# Altium schematic sheet [1]isoSPI.SchDoc
size A4; SheetNumber: 1; SheetTotal: 2
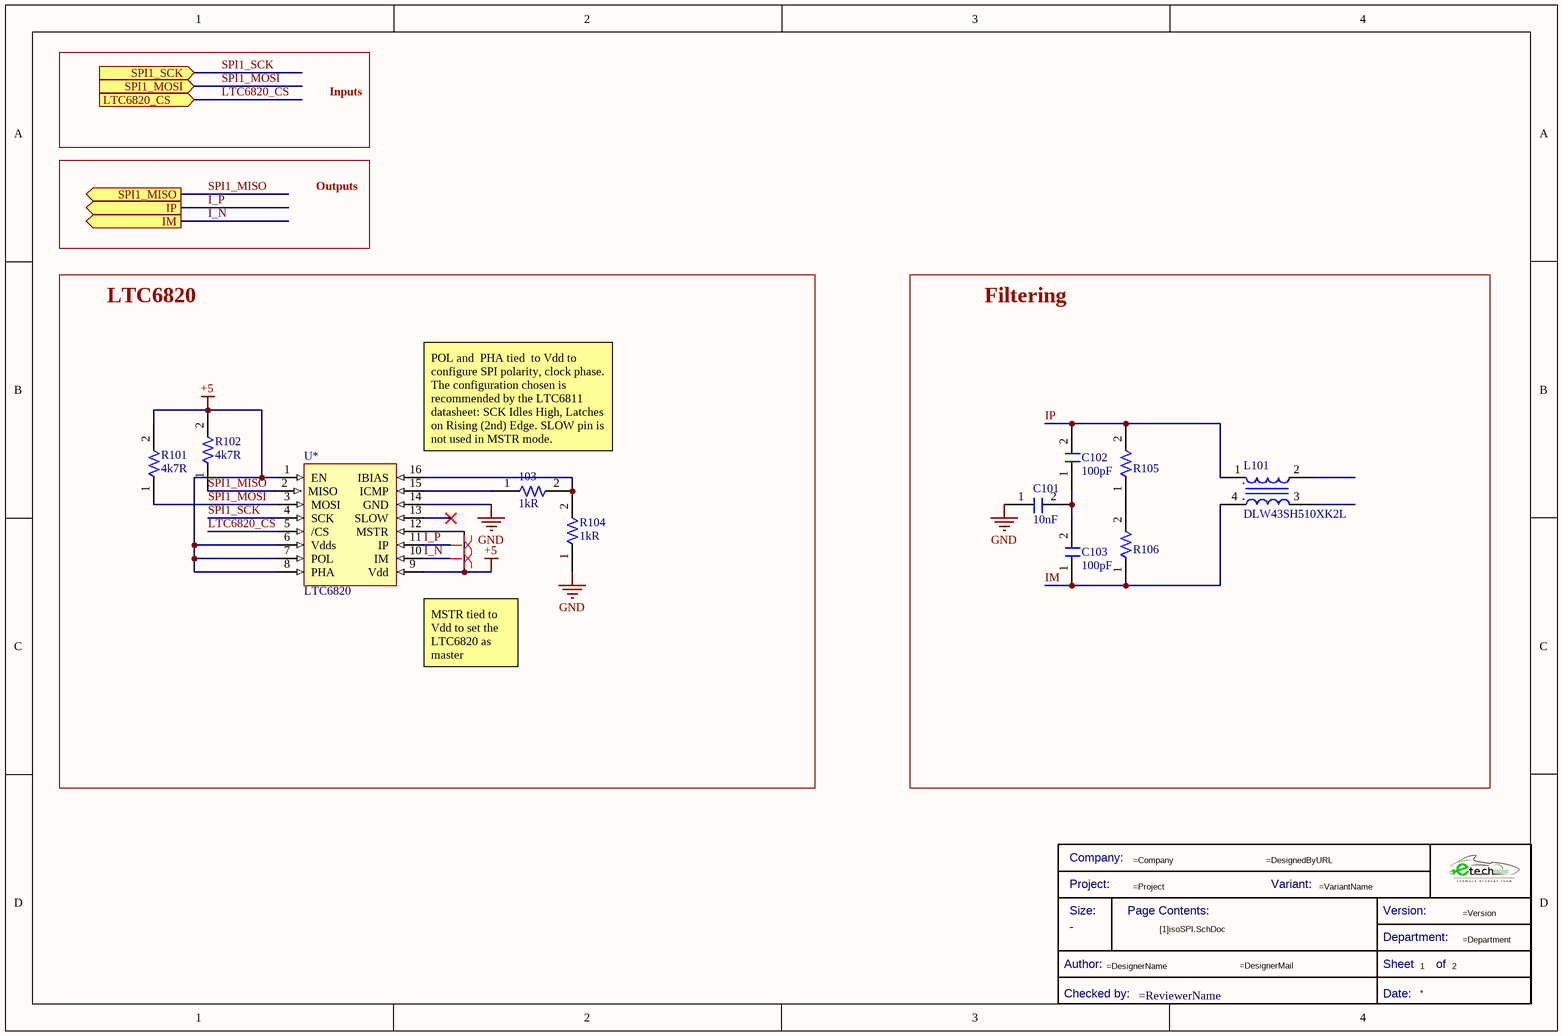
[diagram p0: [1]isoSPI.SchDoc]

## Parts
103  Resistance: 1kR  [R0805FTK]  (hidden comment: CR0805-JW-102ELF)
*  Title Block_template  (value not drawn)  (graphical)
C101  Capacitance: 10nF  [C1206FNPC-RW]  (hidden comment: 885012008055)
C102  Capacitance: 100pF  [C0805FNPC-W]  (hidden comment: 885012007057)
C103  Capacitance: 100pF  [C0805FNPC-W]  (hidden comment: 885012007057)
L101  Supplier Part Number 1: DLW43SH510XK2L  [CMC-51uH-230mA]  (hidden comment: CMC-51uH-DLW43SH510XK2L)
R101  Resistance: 4k7R  [R0805FTK]  (hidden comment: CR0805-JW-472ELF)
R102  Resistance: 4k7R  [R0805FTK]  (hidden comment: CR0805-JW-472ELF)
R104  Resistance: 1kR  [R0805FTK]  (hidden comment: CR0805-JW-102ELF)
R105  CRCW080550R0FKTA  [R0805FTK]  (value not drawn)
R106  CRCW080550R0FKTA  [R0805FTK]  (value not drawn)
U*  LTC6820  [LTC6820]

## Blocks framed on the sheet
LTC6820: 103 R101 R102 R104 U*
Filtering: C101-C103 L101 R105 R106

## Ports
IM (out), IP (out), LTC6820_CS (in), SPI1_MISO (out), SPI1_MOSI (in), SPI1_SCK (in)

## Nets
+5: R101.2 R102.2 U*.1(EN) U*.6(Vdds) U*.7(POL) U*.8(PHA) U*.9(Vdd) U*.12(MSTR)
GND: C101.1 R104.1 U*.14(GND)
I_N: U*.10(IM) ; port IM
I_P: U*.11(IP) ; port IP
IM: C103.1 L101.4(4_IN) R106.1
IP: C102.2 L101.1(1_IN) R105.2
LTC6820_CS: U*.5(/CS) ; port LTC6820_CS
SPI1_MISO: R102.1 U*.2(MISO) ; port SPI1_MISO
SPI1_MOSI: R101.1 U*.3(MOSI) ; port SPI1_MOSI
SPI1_SCK: U*.4(SCK) ; port SPI1_SCK
Net103_1: 103.1 U*.15(ICMP)
Net103_2: 103.2 R104.2 U*.16(IBIAS)
NetC101_2: C101.2 C102.1 C103.2
NetR105_1: R105.1 R106.2

Not connected (* = marked no-connect by the designer): L101 2(2_OUT) 3(3_OUT); U* 13(SLOW)*

## Layout directives
differential pair: I_N, I_P

## Notes on the sheet
- Inputs
- Outputs
- POL and  PHA tied  to Vdd to configure SPI polarity, clock phase.
  The configuration chosen is recommended by the LTC6811 datasheet: SCK Idles High, Latches on Rising (2nd) Edge. SLOW pin is not used in MSTR mode.
- (near U*) MSTR tied to Vdd to set the LTC6820 as master
- (in symbol Title Block_template) Company:; Project:; Variant:; Size:; Page Contents:; Version:; Department:; Author:; Sheet; of; Checked by:; Date:

## Library data of the parts
103 R104 = R1k-0805FTK: Res Thick Film 0805 1K Ohm 5% 1/8W ±200ppm/°C Molded SMD SMD Paper Tape on Plastic Reel; Manufacturer 1: Bourns; Voltage Rating (DC): 150V; Power Rating: 125mW; .Creator: GP; Supplier 1: Arrow Electronics; Manufacturer Part Number 1: CR0805-JW-102ELF; RoHS: Yes; Category: Chip SMD Resistors; Stock 1: 27510; Pricing 1: 1=0,05930, 10=0,03510, 25=0,01790, 100=0,00800, 250=0,00790, 500=0,00590, 1000=0,00360, 3000=0,00350, 6000=0,00250 (USD); Mount: Surface Mount; Case/Package: 0805; Number of Pins: 2; Contact Plating: Tin; Case Code (Metric): 2012; Case Code (Imperial): 0805; Min Operating Temperature: -55°C; Max Operating Temperature: 155°C; Resistor Type: Thick Film; Tolerance: 5%; Temperature Coefficient: 200ppm/°C; Features: Moisture Resistant; Package Quantity: 1; Packaging: Tape and Reel; Voltage Rating: 150V; Number of Terminations: 2; Termination: SMD/SMT; Max Power Dissipation: 125mW; Length: 2mm; Width: 1.25mm; Height: 0.5mm; Thickness: 508um; Depth: 1.25mm; Radiation Hardening: No; Lead Free: Lead Free; REACH SVHC: No SVHC; Military Standard: Not; ComponentLink1URL: https://datasheet.ciiva.com/11821/0900766b80fcdb72-11821134.pdf?src-supplier=RSComponents; ComponentLink1Description: https://datasheet.ciiva.com/11821/0900766b80fcdb72-11821134.pdf?src-supplier=RSComponents; ComponentLink2URL: https://datasheet.ciiva.com/15225/getdatasheetpartid-78155-15225381.pdf?src-supplier=Verical; ComponentLink2Description: https://datasheet.ciiva.com/15225/getdatasheetpartid-78155-15225381.pdf?src-supplier=Verical; ComponentLink3URL: https://datasheet.ciiva.com/22693/1902866-22693253.pdf?src-supplier=Element14; ComponentLink3Description: https://datasheet.ciiva.com/22693/1902866-22693253.pdf?src-supplier=Element14; ComponentLink4URL: https://datasheet.ciiva.com/7986/1856384-7986184.pdf?src-supplier=Element14; ComponentLink4Description: https://datasheet.ciiva.com/7986/1856384-7986184.pdf?src-supplier=Element14; ComponentLink5URL: https://datasheet.ciiva.com/7985/1856384-7985867.pdf?src-supplier=Element14; ComponentLink5Description: https://datasheet.ciiva.com/7985/1856384-7985867.pdf?src-supplier=Element14; ComponentLink6URL: https://datasheet.ciiva.com/30242/159chpreztr-30242765.pdf?src-supplier=Onlinecomponents.com; ComponentLink6Description: https://datasheet.ciiva.com/30242/159chpreztr-30242765.pdf?src-supplier=Onlinecomponents.com; ComponentLink7URL: https://datasheet.ciiva.com/6547/chpreztr-6547359.pdf?src-supplier=Digi-Key; ComponentLink7Description: https://datasheet.ciiva.com/6547/chpreztr-6547359.pdf?src-supplier=Digi-Key; Supplier Part Number 1: CR0805-JW-102ELF
* = Title Block_template: Standard Title Block; .Creator: GP; Category: Title Block; .PCBcheck: GP; .SCHcheck: GP; Checked by:: =ReviewerName; Size: -
C101 = C10n-50V-1206FNPC-C0G/NP0: Cap Cer 10000PF 50V C0G/NP0 1206; Manufacturer: Wurth Electronics; Tolerance: 5%; .Creator: DO; Supplier 1: Mouser; Manufacturer Part Number: 885012008055; RoHS: Yes; Category: Ceramic Capacitors; Stock 1: 4648; Pricing 1: 1=0,40000, 10=0,35800, 50=0,35800, 100=0,32100, 1000=0,28400, 10000=0,17200 (USD); Mount: Surface Mount; Case/Package: 1206; Case Code (Metric): 3216; Case Code (Imperial): 1206; Min Operating Temperature: -55°C; Max Operating Temperature: 125°C; Packaging: Tape and Reel; Voltage Rating: 50V; Length: 0.126inch; Width: 0.063inch; Thickness: 0.053inch; ComponentLink1URL: https://katalog.we-online.de/pbs/datasheet/885012008055.pdf?src-supplier=Digi-Key; ComponentLink1Description: https://katalog.we-online.de/pbs/datasheet/885012008055.pdf?src-supplier=Digi-Key; Supplier Part Number 1: 710-885012008055; ComponentLink2Description: Where buy it; ComponentLink2URL: https://www.we-online.com/catalog/en/WCAP-CSGP-50VDC#885012207092
C102 C103 = C100p-50V-0805FNPC-C0G/NP0: Multilayer Ceramic Capacitor, Wcap-Csgp Series, 100 Pf, 5%, C0G / Np0, 50 V, 0805 [2012 Metric] Rohs Compliant: Yes; Manufacturer: Wurth Electronics; Voltage Rating: 50V; .Creator: DR; Supplier 1: RSComponents; Manufacturer Part Number: 885012007057; RoHS: Yes; Category: Ceramic Capacitors; Stock 1: 1; Pricing 1: 4000=0,03900, 12000=0,03800 (USD); Mount: Surface Mount; Case/Package: 0805; Case Code (Metric): 2012; Case Code (Imperial): 0805; Min Operating Temperature: -55°C; Max Operating Temperature: 125°C; Packaging: Cut Tape; Dielectric: C0G; Tolerance: 5%; Voltage Rating (DC): 50V; Length: 0.079inch; Width: 0.049inch; Thickness: 0.035inch; REACH SVHC: Unknown; RoHS Compliant: Yes; ComponentLink1URL: http://www.farnell.com/datasheets/1958443.pdf?src-supplier=Farnell; ComponentLink1Description: http://www.farnell.com/datasheets/1958443.pdf?src-supplier=Farnell; ComponentLink2URL: https://katalog.we-online.de/pbs/datasheet/885012007057.pdf?src-supplier=Digi-Key; ComponentLink2Description: https://katalog.we-online.de/pbs/datasheet/885012007057.pdf?src-supplier=Digi-Key; ComponentLink3URL: http://www.farnell.com/datasheets/1958443.pdf?src-supplier=Element14; ComponentLink3Description: http://www.farnell.com/datasheets/1958443.pdf?src-supplier=Element14; ComponentLink4URL: http://www.farnell.com/datasheets/1958443.pdf?src-supplier=Newark; ComponentLink4Description: http://www.farnell.com/datasheets/1958443.pdf?src-supplier=Newark; ComponentLink5Description: Where buy it; ComponentLink5URL: https://www.we-online.com/catalog/en/WCAP-CSGP-50VDC#885012007057; Supplier Part Number 1: 1813930
L101 = CMC-51uH-230mA: Ind Common Mode Choke Wirewound 51uH -30% to 50% 1MHz 230mA 1812 Embossed Plastic T/R; Manufacturer: Murata; Number of Lines: 2; Shielding: Unshielded; DC Resistance (DCR): 1R; Test Frequency: 100MHz; Voltage Rating (DC): 50V; Specifications sheet: https://www.murata.com/products/productdata/8804914298910/QFLC9127.pdf?1681702277000; Supplier 1: Arrow Electronics; Manufacturer Part Number: DLW43SH510XK2L; RoHS: Yes; Category: Common Mode Chokes; Stock 1: 6000; Pricing 1: 500=0,4125, 1000=0,385, 2500=0,361, 10000=0,3484 (USD); Mounting Technology: Surface Mount; Case/Package: 1812; Weight: 0.005997oz; Case Code (Metric): 4532; Case Code (Imperial): 1812; Min Operating Temperature: -40°C; Max Operating Temperature: 125°C; Package Quantity: 1; Packaging: Tape and Reel; Tolerance: 50%; Current Rating: 230mA; Value: 51uH; Current: 230mA; Max DC Current: 230mA; Termination: SMD/SMT; DC Current: 230mA; Series: DLW43S; Max Current Rating: 230mA; Length: 4.5mm; Width: 0.126inch; Height: 2.6mm; Depth: 3.4mm; Ratings: AEC-Q200; Military Standard: Not; Reach SVHC Compliant: No; Lead Free: Lead Free; RoHS Compliant: Yes; ComponentLink1URL: https://datasheet.ciiva.com/8506/l0132s0197dlw43s-8506349.pdf?src-supplier=Avnet; ComponentLink1Description: https://datasheet.ciiva.com/8506/l0132s0197dlw43s-8506349.pdf?src-supplier=Avnet
R101 R102 = R4.7K-0805FTK: Res Thick Film 0805 4.7K Ohm 5% 1/8W ±200ppm/°C Molded SMD SMD Paper Tape on Plastic Reel; Manufacturer 1: Bourns; Power Rating: 125mW; Voltage Rating: 150V; .Creator: DR; Supplier 1: Arrow Electronics; Manufacturer Part Number 1: CR0805-JW-472ELF; RoHS: Yes; Category: Chip SMD Resistors; Stock 1: 3734; Pricing 1: 1=0,05590, 10=0,01670, 25=0,01290, 100=0,00840, 250=0,00830, 500=0,00690, 1000=0,00410 (USD); Mount: Surface Mount; Case/Package: 0805; Case Code (Metric): 2012; Case Code (Imperial): 0805; Contact Plating: Tin; Min Operating Temperature: -55°C; Max Operating Temperature: 155°C; Packaging: Tape and Reel; Tolerance: 5%; Package Quantity: 1; Resistor Type: Thick Film; Number of Terminations: 2; Termination: SMD/SMT; Temperature Coefficient: 200ppm/°C; Max Power Dissipation: 125mW; Voltage Rating (DC): 150V; Features: Moisture Resistant; Series: CR0805; Resistance Tolerance: 5%; Construction: Rectangular; Length: 2mm; Width: 0.049inch; Height: 0.024inch; Depth: 1.25mm; Thickness: 508um; Radiation Hardening: No; REACH SVHC: No SVHC; Military Standard: Not; RoHS Compliant: Yes; ComponentLink1URL: https://datasheet.ciiva.com/5541/chpreztr-5541593.pdf?src-supplier=Mouser; ComponentLink1Description: https://datasheet.ciiva.com/5541/chpreztr-5541593.pdf?src-supplier=Mouser; ComponentLink2URL: https://datasheet.ciiva.com/6560/chpreztr-6560073.pdf?src-supplier=Digi-Key; ComponentLink2Description: https://datasheet.ciiva.com/6560/chpreztr-6560073.pdf?src-supplier=Digi-Key; ComponentLink3URL: https://datasheet.ciiva.com/6560/chpreztr-6560074.pdf?src-supplier=Digi-Key; ComponentLink3Description: https://datasheet.ciiva.com/6560/chpreztr-6560074.pdf?src-supplier=Digi-Key; ComponentLink4URL: https://datasheet.ciiva.com/30174/159chpreztr-30174252.pdf?src-supplier=Onlinecomponents.com; ComponentLink4Description: https://datasheet.ciiva.com/30174/159chpreztr-30174252.pdf?src-supplier=Onlinecomponents.com; ComponentLink5URL: https://datasheet.ciiva.com/9122/chpreztr-9122814.pdf?src-supplier=Avnet; ComponentLink5Description: https://datasheet.ciiva.com/9122/chpreztr-9122814.pdf?src-supplier=Avnet; ComponentLink6URL: https://datasheet.ciiva.com/22713/691949-22713272.pdf?src-supplier=Element14; ComponentLink6Description: https://datasheet.ciiva.com/22713/691949-22713272.pdf?src-supplier=Element14; ComponentLink7URL: https://datasheet.ciiva.com/6560/chpreztr-6560075.pdf?src-supplier=Digi-Key; ComponentLink7Description: https://datasheet.ciiva.com/6560/chpreztr-6560075.pdf?src-supplier=Digi-Key; Supplier Part Number 1: CR0805-JW-472ELF
R105 R106 = R50-0805FTK: Res Thick Film 0805 50 Ohm 1% 0.125W(1/8W) ±100ppm/C Pad SMD Automotive T/R; Manufacturer: Vishay Dale; Value: 50R; Power Rating: 125mW; Voltage Rating: 150V; Temperature Coefficient: 100ppm/°C; Supplier 1: Mouser; Manufacturer Part Number: CRCW080550R0FKTA; RoHS: No; Category: Chip SMD Resistors; Stock 1: 38245; Pricing 1: 1=0,25, 10=0,204, 50=0,204, 100=0,08, 1000=0,033, 10000=0,026 (USD); Case/Package: 0805; Weight: 0.000194oz; Case Code (Imperial): 0805; Case Code (Metric): 2012; Contact Plating: Tin,Lead; Min Operating Temperature: -55°C; Max Operating Temperature: 155°C; Tolerance: 1%; Packaging: Tape and Reel; Package Quantity: 5000; Series: CRCW; Length: 2mm; Width: 1.25mm; Height: 0.45mm; Lead Free: Contains Lead; RoHS Compliant: No; ComponentLink1URL: https://datasheet.ciiva.com/48525/dcrcw-48525895.pdf?src-supplier=Avnet; ComponentLink1Description: https://datasheet.ciiva.com/48525/dcrcw-48525895.pdf?src-supplier=Avnet; Supplier Part Number 1: 71-CRCW0805-50
U* = U_LTC6820